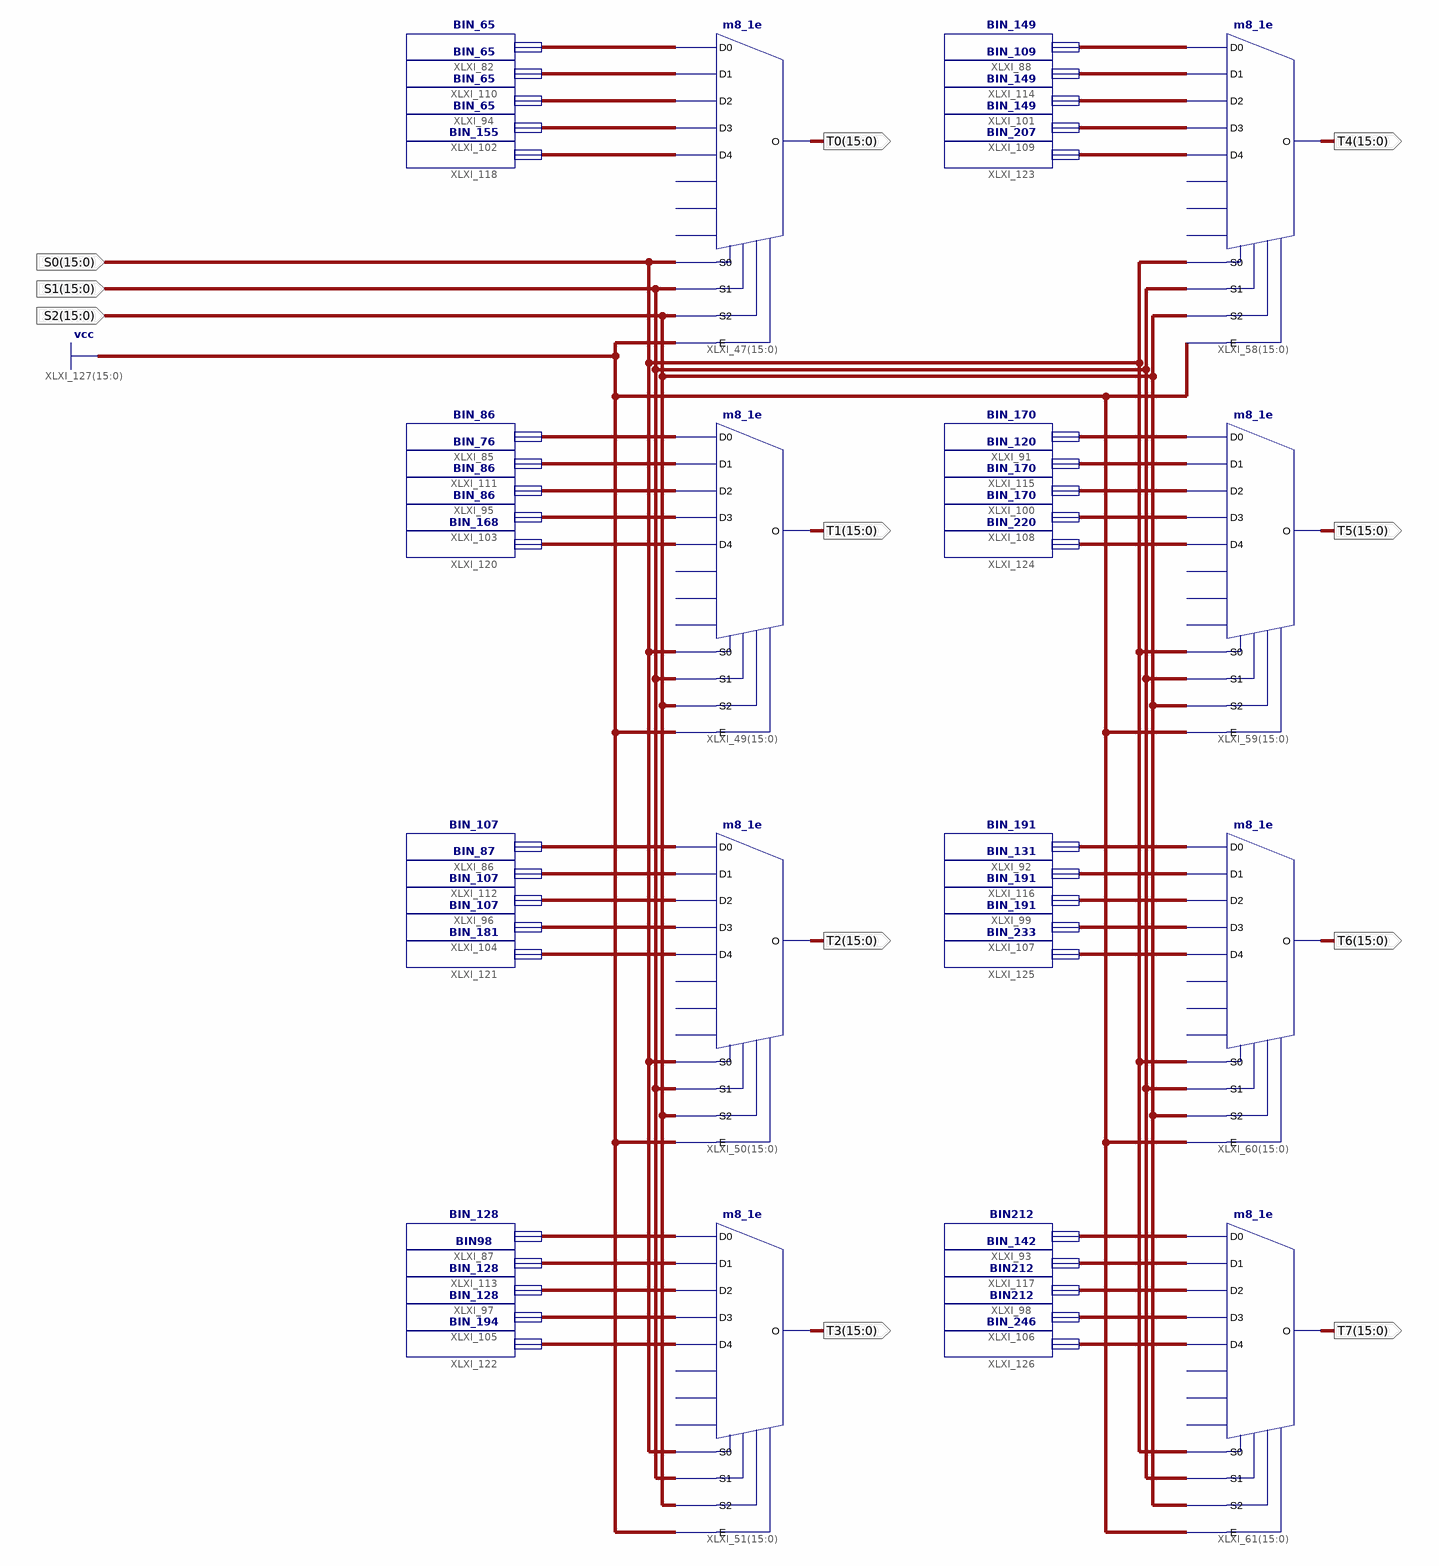
[diagram p0: schematic sheet 1]
// Xilinx ISE schematic ScaleThreshold_x8.sch (spartan6) as structural Verilog: 48 symbols, 11 ports
module ScaleThreshold_x8 (
  input  [15:0] S0,
  input  [15:0] S1,
  input  [15:0] S2,
  output [15:0] T0,
  output [15:0] T4,
  output [15:0] T5,
  output [15:0] T1,
  output [15:0] T2,
  output [15:0] T6,
  output [15:0] T7,
  output [15:0] T3
);

  wire [15:0] XLXN_43, XLXN_44, XLXN_45, XLXN_46, XLXN_47, XLXN_50, XLXN_51, XLXN_52, XLXN_53, XLXN_54,
       XLXN_55, XLXN_56, XLXN_57, XLXN_58, XLXN_59, XLXN_60, XLXN_61, XLXN_62, XLXN_63, XLXN_64, XLXN_65,
       XLXN_66, XLXN_67, XLXN_68, XLXN_69, XLXN_70, XLXN_71, XLXN_72, XLXN_73, XLXN_74, XLXN_75, XLXN_76,
       XLXN_77, XLXN_78, XLXN_79, XLXN_80, XLXN_81, XLXN_82, XLXN_83, XLXN_84;

  m8_1e XLXI_49[15:0] (
    .D0(XLXN_44), .D1(XLXN_71), .D2(XLXN_54), .D3(XLXN_62), .D4(XLXN_79), .E({16{1'b1}}), .S0(S0), .S1(S1),
    .S2(S2), .O(T1));  // open: D5, D6, D7
  m8_1e XLXI_50[15:0] (
    .D0(XLXN_45), .D1(XLXN_74), .D2(XLXN_55), .D3(XLXN_63), .D4(XLXN_82), .E({16{1'b1}}), .S0(S0), .S1(S1),
    .S2(S2), .O(T2));  // open: D5, D6, D7
  m8_1e XLXI_51[15:0] (
    .D0(XLXN_46), .D1(XLXN_75), .D2(XLXN_56), .D3(XLXN_64), .D4(XLXN_83), .E({16{1'b1}}), .S0(S0), .S1(S1),
    .S2(S2), .O(T3));  // open: D5, D6, D7
  m8_1e XLXI_58[15:0] (
    .D0(XLXN_47), .D1(XLXN_70), .D2(XLXN_60), .D3(XLXN_68), .D4(XLXN_78), .E({16{1'b1}}), .S0(S0), .S1(S1),
    .S2(S2), .O(T4));  // open: D5, D6, D7
  m8_1e XLXI_59[15:0] (
    .D0(XLXN_52), .D1(XLXN_72), .D2(XLXN_59), .D3(XLXN_67), .D4(XLXN_80), .E({16{1'b1}}), .S0(S0), .S1(S1),
    .S2(S2), .O(T5));  // open: D5, D6, D7
  m8_1e XLXI_60[15:0] (
    .D0(XLXN_51), .D1(XLXN_73), .D2(XLXN_58), .D3(XLXN_66), .D4(XLXN_81), .E({16{1'b1}}), .S0(S0), .S1(S1),
    .S2(S2), .O(T6));  // open: D5, D6, D7
  m8_1e XLXI_61[15:0] (
    .D0(XLXN_50), .D1(XLXN_76), .D2(XLXN_57), .D3(XLXN_65), .D4(XLXN_84), .E({16{1'b1}}), .S0(S0), .S1(S1),
    .S2(S2), .O(T7));  // open: D5, D6, D7
  m8_1e XLXI_47[15:0] (
    .D0(XLXN_43), .D1(XLXN_69), .D2(XLXN_53), .D3(XLXN_61), .D4(XLXN_77), .E({16{1'b1}}), .S0(S0), .S1(S1),
    .S2(S2), .O(T0));  // open: D5, D6, D7
  BIN_65 XLXI_82 (.OUTPUT(XLXN_43));
  BIN_86 XLXI_85 (.OUTPUT(XLXN_44));
  BIN_107 XLXI_86 (.OUTPUT(XLXN_45));
  BIN_128 XLXI_87 (.OUTPUT(XLXN_46));
  BIN_149 XLXI_88 (.OUTPUT(XLXN_47));
  BIN_170 XLXI_91 (.OUTPUT(XLXN_52));
  BIN_191 XLXI_92 (.OUTPUT(XLXN_51));
  BIN212 XLXI_93 (.OUTPUT(XLXN_50));
  BIN_65 XLXI_94 (.OUTPUT(XLXN_53));
  BIN_86 XLXI_95 (.OUTPUT(XLXN_54));
  BIN_107 XLXI_96 (.OUTPUT(XLXN_55));
  BIN_128 XLXI_97 (.OUTPUT(XLXN_56));
  BIN212 XLXI_98 (.OUTPUT(XLXN_57));
  BIN_191 XLXI_99 (.OUTPUT(XLXN_58));
  BIN_170 XLXI_100 (.OUTPUT(XLXN_59));
  BIN_149 XLXI_101 (.OUTPUT(XLXN_60));
  BIN_65 XLXI_102 (.OUTPUT(XLXN_61));
  BIN_86 XLXI_103 (.OUTPUT(XLXN_62));
  BIN_107 XLXI_104 (.OUTPUT(XLXN_63));
  BIN_128 XLXI_105 (.OUTPUT(XLXN_64));
  BIN212 XLXI_106 (.OUTPUT(XLXN_65));
  BIN_191 XLXI_107 (.OUTPUT(XLXN_66));
  BIN_170 XLXI_108 (.OUTPUT(XLXN_67));
  BIN_149 XLXI_109 (.OUTPUT(XLXN_68));
  BIN_65 XLXI_110 (.OUTPUT(XLXN_69));
  BIN_76 XLXI_111 (.OUTPUT(XLXN_71));
  BIN_87 XLXI_112 (.OUTPUT(XLXN_74));
  BIN98 XLXI_113 (.OUTPUT(XLXN_75));
  BIN_109 XLXI_114 (.OUTPUT(XLXN_70));
  BIN_120 XLXI_115 (.OUTPUT(XLXN_72));
  BIN_131 XLXI_116 (.OUTPUT(XLXN_73));
  BIN_142 XLXI_117 (.OUTPUT(XLXN_76));
  BIN_155 XLXI_118 (.OUTPUT(XLXN_77));
  BIN_168 XLXI_120 (.OUTPUT(XLXN_79));
  BIN_181 XLXI_121 (.OUTPUT(XLXN_82));
  BIN_194 XLXI_122 (.OUTPUT(XLXN_83));
  BIN_207 XLXI_123 (.OUTPUT(XLXN_78));
  BIN_220 XLXI_124 (.OUTPUT(XLXN_80));
  BIN_233 XLXI_125 (.OUTPUT(XLXN_81));
  BIN_246 XLXI_126 (.OUTPUT(XLXN_84));
endmodule
